# EasyEDA Pro project 太丑了，别瞎几把抄.epro

# Schematic Schematic1
Create Date: 2023-05-21; Page Name: P1; Project Name: 信号实验; Schematic Name: Schematic1; Update Date: 2023-05-22; Company: 嘉立创EDA; Page Size: A4; Version: V1.0
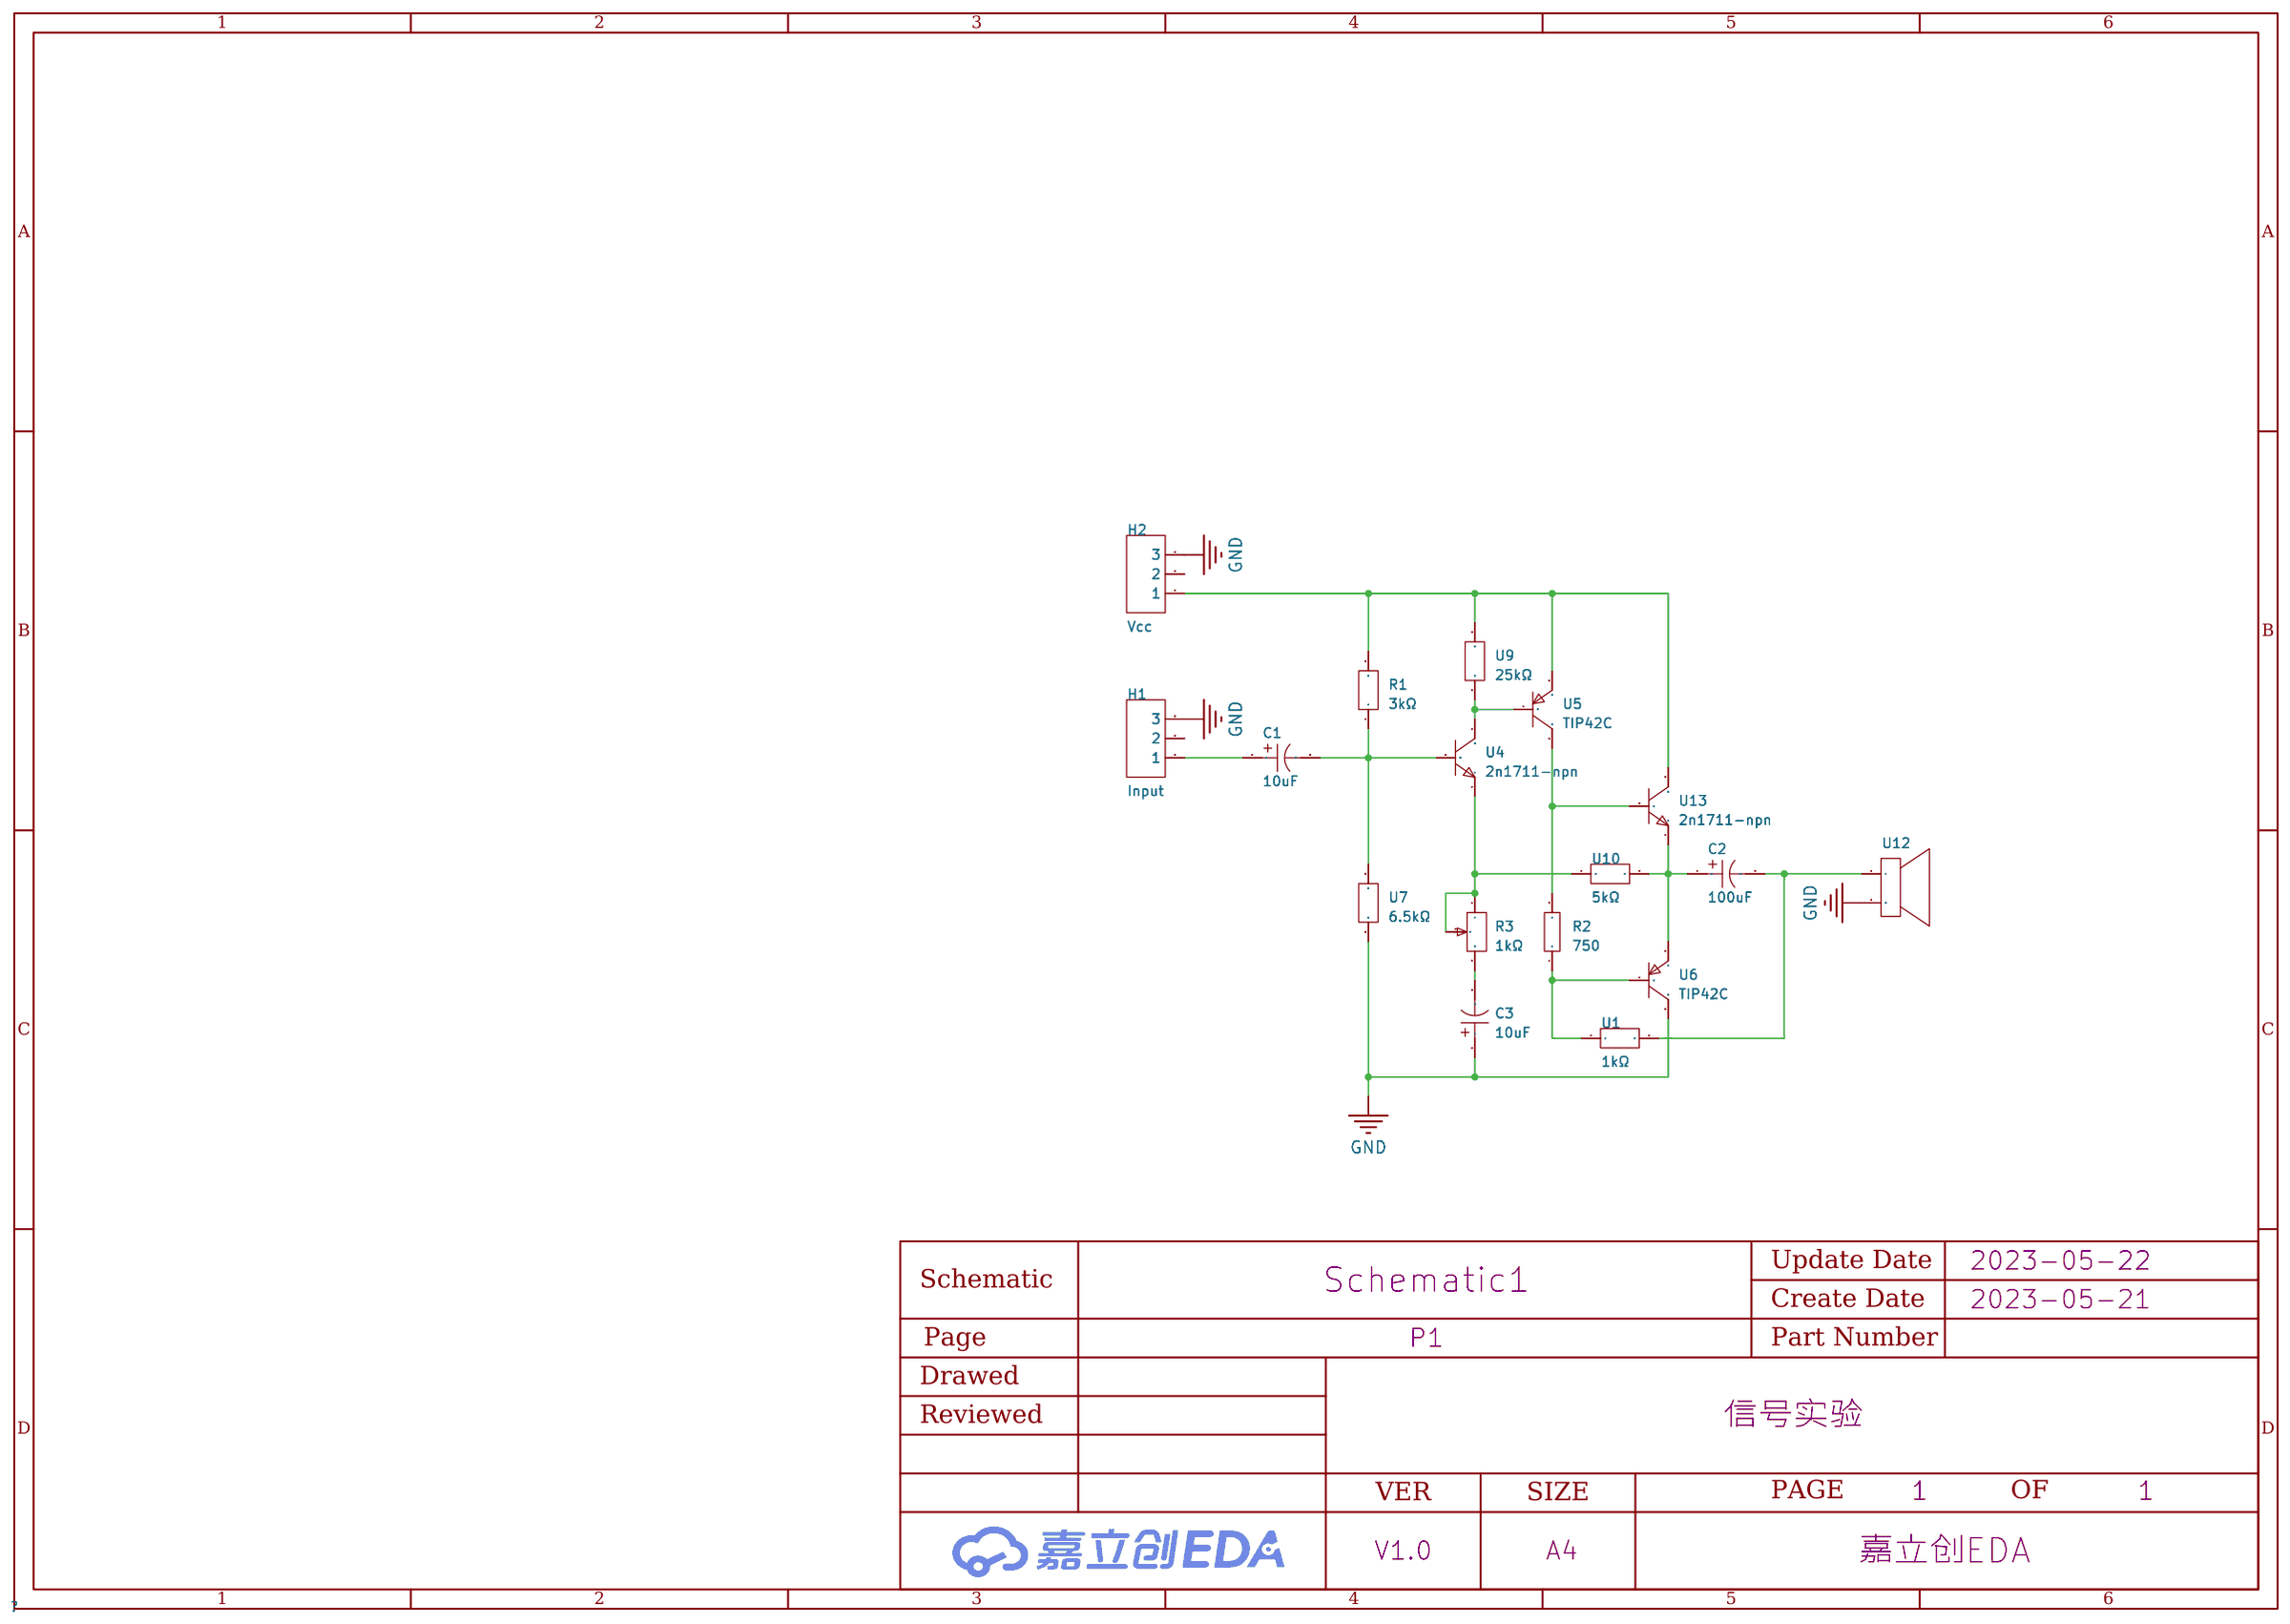
[diagram p0: schematic sheet]

## Parts
C1  10uF  [CAP-TH_BD5.0-P2.00-D0.6-FD]
C2  100uF  [CAP-TH_BD6.3-P2.50-D0.5-FD]
C3  10uF  [CAP-TH_BD5.0-P2.00-D0.6-FD]
H1  Input  [HDR-TH_3P-P2.54-V-M-1]
H2  Vcc  [HDR-TH_3P-P2.54-V-M-1]
R1  3kΩ  [RES-TH_BD3.0-L7.0-P14.5-D0.42]
R2  750  [RES-TH_BD3.0-L7.0-P14.5-D0.42]
R3  1kΩ  [RES-ADJ-TH_3296W]
U1  1kΩ  [RES-TH_BD3.0-L7.0-P14.5-D0.42]
U4  2n1711-npn  [TO-39-3_BD9.2-P2.54_D210HX]
U5  TIP42C  [TO-220-3_L10.0-W4.5-P2.54-L]
U6  TIP42C  [TO-220-3_L10.0-W4.5-P2.54-L]
U7  6.5kΩ  [RES-TH_BD3.0-L7.0-P14.5-D0.42]
U9  25kΩ  [RES-TH_BD3.0-L7.0-P14.5-D0.42]
U10  5kΩ  [RES-TH_BD3.0-L7.0-P14.5-D0.42]
U12  -  [SIL-2]
U13  2n1711-npn  [TO-39-3_BD9.2-P2.54_D210HX]

## Library data of the parts
C1 C3 = 50V10uF CD110: 容值:10uF;精度:±20%;额定电压:50V;; LCSC Part Name: 10uF ±20% 50V; Supplier Part: C2960200; Manufacturer: HRK(鸿瑞凯电子); Supplier Footprint: 插件,D5xL7mm; JLCPCB Part Class: 扩展库; Datasheet: https://atta.szlcsc.com/upload/public/pdf/source/20220224/E11F40A390421459FFAC7D4A6BAF4847.pdf; Supplier: LCSC; Tolerance: ±20%; Rated Voltage: 50V; φD: 5mm; L: 7mm; Lead Spacing: 2mm; Operating Temperature: -40℃~+105℃
C2 = ERS1VM101E12B25T: 容值:100uF;精度:±20%;额定电压:35V;纹波电流:-;等效串联电阻:-;; LCSC Part Name: 100uF ±20% 35V; Supplier Part: C5128219; Manufacturer: AISHI(艾华集团); Supplier Footprint: 插件,6.3x12mm; JLCPCB Part Class: 扩展库; Datasheet: https://atta.szlcsc.com/upload/public/pdf/source/20220805/16236AF79CA5FAEDC6064E5DDF891E29.pdf; Supplier: LCSC; Tolerance: ±20%; Rated Voltage: 35V; φD: 6.3mm; L: 12mm; Lead Spacing: 2.5mm; Operating Temperature: -40℃~+105℃
H1 H2 = 2.54-1*3P针: 排数:单排;总PIN位数:3;间距:2.54mm;插针结构:1x3P;行距:-;安装类型:直插;圆针/方针:方针;额定电流:3A;额定电压:-;配合针长度:-;塑高:-;端接针长度:-;触头材质:-;触头镀层:-;工作温度范围:-40℃~+105℃;颜色:黑色;; LCSC Part Name: 2.54mm 1x3P 直插 方针; Supplier Part: C49257; Manufacturer: BOOMELE(博穆精密); Supplier Footprint: 插件,P=2.54mm; JLCPCB Part Class: 扩展库; Datasheet: https://atta.szlcsc.com/upload/public/pdf/source/20221018/3E9408392E35E6F57A28985E5F7BF5C9.pdf; Supplier: LCSC; Number of Rows: 单排; Number of Pins: 3; Pitch: 2.54mm; Pin Structure: 1x3P; Mounting Type: 直插; Circluar Pins/Square Pins: 方针; Current Rating (Max): 3A; Operating Temperature Range: -40℃~+105℃; Color: 黑色
R1 = OL3025E-R52: 电阻类型:碳膜电阻;阻值:3kΩ;精度:±5%;功率:500mW;温度系数:-450ppm/℃;工作温度范围:-;; LCSC Part Name: 碳膜电阻 3kΩ ±5% 500mW; Supplier Part: C3490234; Manufacturer: Ohmite; Supplier Footprint: 轴向引线; JLCPCB Part Class: 扩展库; Datasheet: https://atta.szlcsc.comnull; Supplier: LCSC; Type: 碳膜电阻; Tolerance: ±5%; Power(Watts): 500mW; Temperature Coefficient: -450ppm/℃
R2 = Res_0603: Supplier Footprint: 0603
R3 = 3296W-1-102LF: 阻值:1kΩ;精度:±10%;功率:500mW;; LCSC Part Name: 1kΩ ±10%; Supplier Part: C57089; Manufacturer: BOURNS; Supplier Footprint: 插件; JLCPCB Part Class: 扩展库; Datasheet: https://atta.szlcsc.com/upload/public/pdf/source/20151026/1457707506403.pdf; Supplier: LCSC; Tolerance: ±10%; Power(Watts): 500mW; Temperature Coefficient: ±100ppm/℃; Turns: 25
U1 = RSS 2W 1K J T52: 阻值:1kΩ;精度:±5%;; LCSC Part Name: 1kΩ ±5%; Supplier Part: C5200473; Manufacturer: Tyohm(幸亚电阻); Supplier Footprint: 插件; JLCPCB Part Class: Extended Part; Datasheet: https://atta.szlcsc.com/upload/public/pdf/source/20220711/ED54AC858B888428DB5F852EB1964021.pdf; Supplier: LCSC; Tolerance: ±5%
U4 U13 = 2n1711-npn
U5 U6 = TIP42C_C3200851: 晶体管类型:PNP;集射极击穿电压(Vceo):100V;集电极电流(Ic):6A;功率(Pd):65W;直流电流增益(hFE@Ic,Vce):15@3A,4V;; LCSC Part Name: PNP 100V 6A; Supplier Part: C3200851; Manufacturer: ST(意法半导体); Supplier Footprint: TO-220; Supplier: LCSC; Transistor Type: PNP; Collector-Emitter Breakdown Voltage (Vceo): 100V; Collector Current (Ic): 6A; Power Dissipation (Pd): 65W; Collector Cut-Off Current (Icbo): 700uA; Collector-Emitter Saturation Voltage (VCE(sat)@Ic,Ib): 1.5V@6A,600mA; DC Current Gain (hFE@Ic,Vce): 15@3A,4V; Operating Temperature: +150℃@(Tj)
U7 = RLR07C6501FSB14: 电阻类型:金属膜电阻;阻值:6.5kΩ;精度:±1%;功率:250mW;温度系数:±100ppm/℃;工作温度范围:-65℃~+150℃;; LCSC Part Name: 金属膜电阻 6.5kΩ ±1% 250mW; Supplier Part: C3421507; Manufacturer: VISHAY(威世); Supplier Footprint: 插件; JLCPCB Part Class: Extended Part; Supplier: LCSC; Type: 金属膜电阻; Tolerance: ±1%; Power(Watts): 250mW; Temperature Coefficient: ±100ppm/℃; Operating Temperature Range: -65℃~+150℃
U9 = MFR200FRF52-25K: 电阻类型:金属膜电阻;阻值:25kΩ;精度:±1%;功率:2W;温度系数:±100ppm/℃;工作温度范围:-55℃~155℃;; LCSC Part Name: 25kΩ ±1% 2W; Supplier Part: C1763307; Manufacturer: YAGEO(国巨); Supplier Footprint: 轴向引线; JLCPCB Part Class: 扩展库; Datasheet: https://atta.szlcsc.com/upload/public/pdf/source/20201029/C911418_CEA09B7112BCFF5AE38F343DDB8D42E7.pdf; Supplier: LCSC; Type: 金属膜电阻; Tolerance: ±1%; Power(Watts): 2W; Temperature Coefficient: ±100ppm/℃; Operating Temperature Range: -55℃~155℃
U10 = MFR50SDRE52-5K: 电阻类型:金属膜电阻;阻值:5kΩ;精度:±0.5%;功率:500mW;温度系数:±50ppm/℃;工作温度范围:-55℃~+155℃;; LCSC Part Name: 5kΩ ±0.5% 500mW; Supplier Part: C1749079; Manufacturer: YAGEO(国巨); Supplier Footprint: 轴向引线,2.4x6.3mm; JLCPCB Part Class: 扩展库; Datasheet: https://atta.szlcsc.com/upload/public/pdf/source/20201029/C911418_CEA09B7112BCFF5AE38F343DDB8D42E7.pdf; Supplier: LCSC; Type: 金属膜电阻; Tolerance: ±0.5%; Power(Watts): 500mW; Temperature Coefficient: ±50ppm/℃; Operating Temperature Range: -55℃~+155℃
U12 = 扬声器

## Nets
GND: C3.1 H1.3 H2.3 U6.2(C) U7.1 U12.2
$1N1086: C1.2 R1.1 U4.2(B) U7.2
$1N1577: C1.1 H1.1
$1N1677: U4.3(C) U5.1(B) U9.1
$1N1795: C3.2 R3.3
$1N1817: C2.1 U6.3(E) U10.2 U13.1(E)
$1N1844: R2.2 U5.2(C) U13.2(B)
$1N1855: H2.1 R1.2 U5.3(E) U9.2 U13.3(C)
$1N2198: C2.2 U1.2 U12.1
$1N2209: R2.1 U1.1 U6.1(B)
$1N2387: R3.1 R3.2 U4.1(E) U10.1

Not connected (* = marked no-connect by the designer): H1 2; H2 2

# Board PCB1
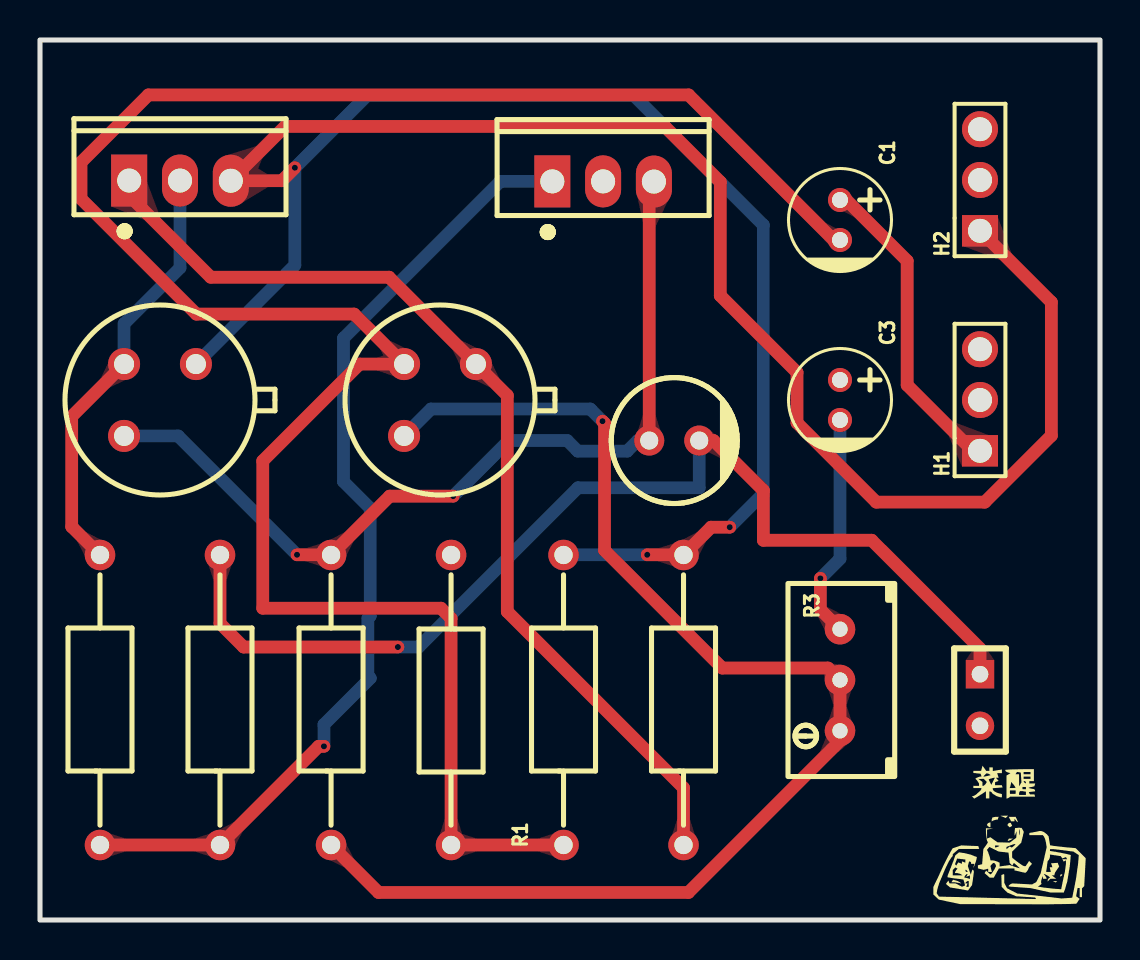
[diagram p1: board, top side]
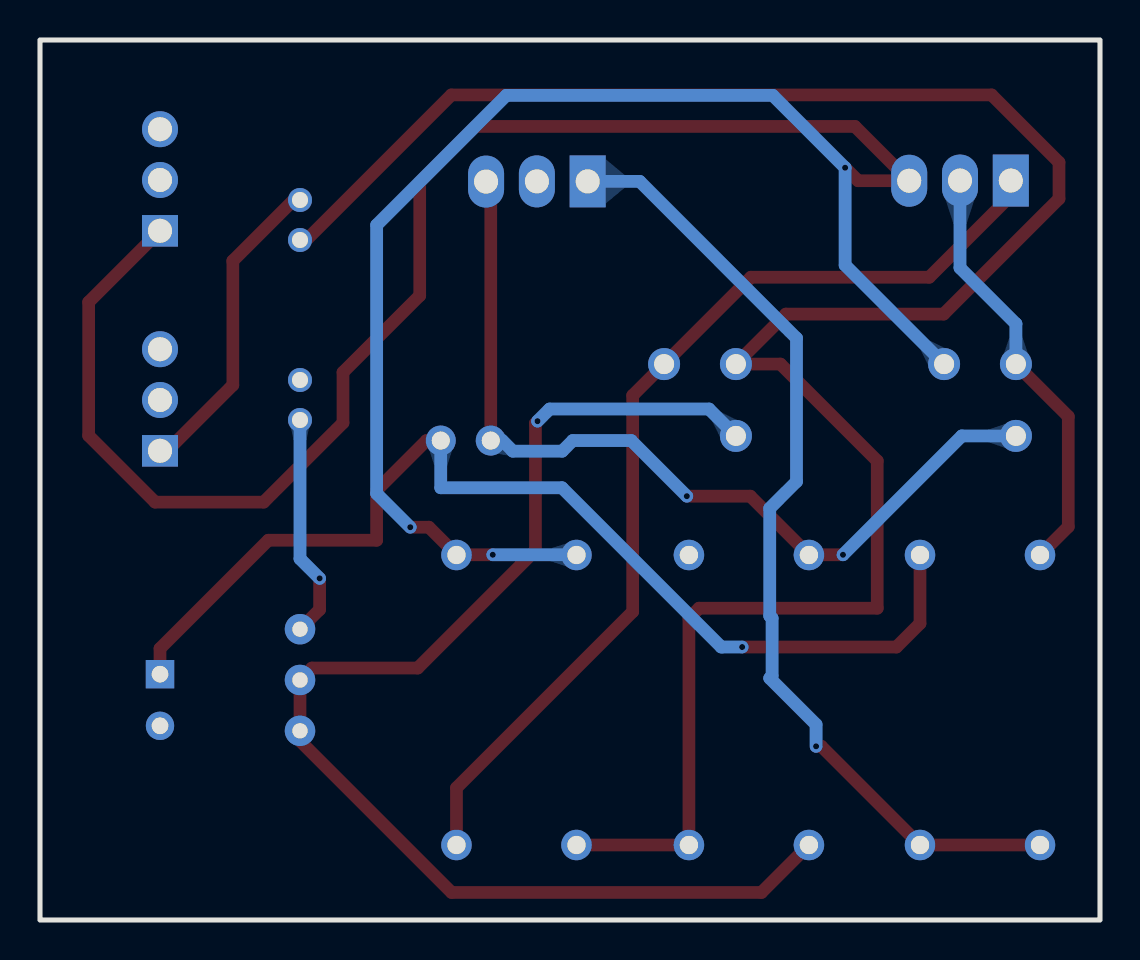
[diagram p2: board, bottom side, seen from below]

Outline 53 x 44 mm; copper layers: Top Layer, Bottom Layer. Coordinates in mm from the lower left corner of the outline.
Outline path: rectangle 0,44 53,0
Stack: Top Layer 0.035mm / Dielectric1 1.51mm FR4 er 4.5 / Bottom Layer 0.035mm

## Design rules (mm)
template: 自定义配置
spacing copperThickness1oz (default): track to track 0.508, other pairs 0.152 to 0.3
spacing copperThickness2oz: track to track 0.203, other pairs 0.152 to 0.3
track width copperThickness1oz (default): min 0.127, default 0.254, max 2.54
track width copperThickness2oz: min 0.203, default 0.254, max 2.54
differential pair differentialPair (default): width min 0.127, default 0.254, max 2.54; gap min 0.152, default 0.152
via viaSize (default): diameter min 0.5, default 0.61, max 10; hole min 0.3, default 0.305, max 6.299

## Placement (name value [footprint] x y rotation side)
C1  10uF  [CAP-TH_BD5.0-P2.00-D0.6-FD]  40 35 270 top
C2  100uF  [CAP-TH_BD6.3-P2.50-D0.5-FD]  31.71 23.97 0 top
C3  10uF  [CAP-TH_BD5.0-P2.00-D0.6-FD]  40 26 270 top
H1  Input  [HDR-TH_3P-P2.54-V-M-1]  47 26 90 top
H2  Vcc  [HDR-TH_3P-P2.54-V-M-1]  47 37 90 top
R1  3kΩ  [RES-TH_BD3.0-L7.0-P14.5-D0.42]  26.18 11 90 top
R2  750  [RES-TH_BD3.0-L7.0-P14.5-D0.42]  3 11 90 top
R3  1kΩ  [RES-ADJ-TH_3296W]  40 12 180 top
U1  1kΩ  [RES-TH_BD3.0-L7.0-P14.5-D0.42]  9 11 90 top
U4  2n1711-npn  [TO-39-3_BD9.2-P2.54_D210HX]  20 26 0 top
U5  TIP42C  [TO-220-3_L10.0-W4.5-P2.54-L]  7 36.97 0 top
U6  TIP42C  [TO-220-3_L10.0-W4.5-P2.54-L]  28.16 36.93 0 top
U7  6.5kΩ  [RES-TH_BD3.0-L7.0-P14.5-D0.42]  20.55 11 270 top
U9  25kΩ  [RES-TH_BD3.0-L7.0-P14.5-D0.42]  32.18 11 90 top
U10  5kΩ  [RES-TH_BD3.0-L7.0-P14.5-D0.42]  14.55 11 90 top
U12  -  [SIL-2]  47 11 270 top
U13  2n1711-npn  [TO-39-3_BD9.2-P2.54_D210HX]  6 26 0 top

## Footprints (pads in the part's own frame, mm; a bottom-side part is the same pattern mirrored in y, then rotated)
CAP-TH_BD5.0-P2.00-D0.6-FD
  round 1.202 hole 0.801: 1(-1,0) 2(1,0)
CAP-TH_BD6.3-P2.50-D0.5-FD
  round 1.5 hole 0.9: 1(-1.25,0) 2(1.25,0)
HDR-TH_3P-P2.54-V-M-1
  rect 1.575x1.8 hole 1.2: 1(-2.54,0)
  round 1.8 hole 1.2: 2(0,0) 3(2.54,0)
RES-ADJ-TH_3296W
  round 1.524 hole 0.762: 1(0,2.54) 2(0,0) 3(0,-2.54)
RES-TH_BD3.0-L7.0-P14.5-D0.42
  round 1.524 hole 0.914: 1(-7.25,0) 2(7.25,0)
SIL-2
  rect 1.42x1.42 hole 0.828: 1(-1.29,0)
  round 1.42 hole 0.828: 2(1.29,0)
TO-39-3_BD9.2-P2.54_D210HX
  round 1.6 hole 1: 1(-1.796,-1.796) 2(-1.796,1.796) 3(1.796,1.796)
TO-220-3_L10.0-W4.5-P2.54-L
  rect 1.8x2.6 hole 1.2: 1(-2.54,0.005)
  oval 1.8x2.6 hole 1.2: 2(0,0.005) 3(2.54,-0.005)

## Nets
As in the schematic.

Pads without a net: H1 2; H2 2

## Via types
v1: diameter 0.61, hole 0.305, Top Layer to Bottom Layer, 9 vias

## Routing (per net, layer and track width the routed paths; a pad name or vN(x,y) marks a point on that pad's centre or on a via; arc(x,y) is an arc through that point)
$1N1086: length 106.8
  Top Layer w0.635: R1.1 U7.2 20.55,15.08 20.05,15.59 11.14,15.59 11.14,22.96 15.98,27.8 U4.2 15.71,30.3 7.82,30.3 2.05,36.06 2.05,37.88 5.42,41.25 32.43,41.25 39.68,34 C1.2
$1N1577: length 15.8
  Top Layer w0.635: C1.1 40.32,36 43.36,32.96 43.36,26.74 46.64,23.46 H1.1
$1N1677: length 49.9
  Top Layer w0.635: U5.1 4.46,36.22 8.54,32.14 17.45,32.14 U4.3 23.37,26.23 23.37,15.42 32.18,6.61 U9.1
$1N1795: length 11.3
  Top Layer w0.635: R3.3 39.02,15.52 v1(39.02,17.08)
  Bottom Layer w0.635: v1(39.02,17.08) 40,18.06 C3.2
$1N1817: length 44.6
  Top Layer w0.635: 14.55,18.26 U10.2 ; 14.55,18.26 v1(12.85,18.26) ; 14.55,18.26 17.48,21.19 v1(20.66,21.19) ; C2.1 30.46,36.69 U6.3
  Bottom Layer w0.635: C2.1 29.89,23.97 29.36,23.44 26.89,23.44 26.36,23.97 23.44,23.97 v1(20.66,21.19) ; U13.1 6.91,24.2 v1(12.85,18.26)
$1N1844: length 21.6
  Top Layer w0.635: U13.2 1.59,25.18 1.59,19.66 R2.2
  Bottom Layer w0.635: U5.2 7,32.61 4.2,29.81 U13.2
$1N1855: length 135.5
  Top Layer w0.635: v1(12.74,37.61) 12.09,36.96 U5.3 12.26,39.68 31.24,39.68 34.01,36.9 34.01,31.22 37.85,27.38 37.85,24.86 41.82,20.89 47.24,20.89 50.57,24.22 50.57,30.89 H2.1 ; 32.18,18.26 U9.2 ; 32.18,18.26 v1(30.36,18.26) ; 32.18,18.26 33.55,19.64 v1(34.49,19.64)
  Bottom Layer w0.635: v1(30.36,18.26) 26.19,18.26 R1.2 ; v1(34.49,19.64) 36.17,21.32 36.17,34.75 29.68,41.23 16.36,41.23 v1(12.74,37.61) 12.74,32.74 U13.3
$1N2198: length 54.6
  Top Layer w0.635: U12.1 47,13.57 41.58,18.99 36.17,18.99 36.17,21.48 33.68,23.97 C2.2 ; v1(17.89,13.65) 10.18,13.65 9,14.83 U1.2
  Bottom Layer w0.635: C2.2 32.96,21.61 26.9,21.61 18.94,13.65 v1(17.89,13.65)
$1N2209: length 48.9
  Top Layer w0.635: v1(14.2,8.68) 13.93,8.68 U1.1 R2.1
  Bottom Layer w0.635: U6.1 23.01,36.93 15.18,29.09 15.18,21.92 16.51,20.58 16.51,15.21 16.4,15.09 16.4,12.21 16.51,12.09 14.2,9.77 v1(14.2,8.68)
$1N2387: length 64.3
  Top Layer w0.635: U10.1 16.93,1.38 32.42,1.38 40,8.96 R3.1 R3.2 39.4,12.6 34.11,12.6 28.23,18.48 28.23,24.84 v1(28.12,24.94)
  Bottom Layer w0.635: U4.1 19.55,25.55 27.52,25.55 v1(28.12,24.94)

## Copper pours and planes (outline as drawn; the poured copper is in the pictures)
GND on Top Layer: -4.86,47.34 62.45,47.34 62.45,-5.75 -4.86,-5.75
GND on Bottom Layer: -7.91,47.85 56.6,47.85 56.6,-7.78 -7.91,-7.78

Small or netless copper shapes (teardrops, artwork), in the pictures only: 35 on Top Layer, 10 on Bottom Layer
